# Altium schematic sheet ALU_Logic.SchDoc
size B; Author: E. Sims; Organization: Let's Build Rockets Inc.; SheetNumber: 1; SheetTotal: 7
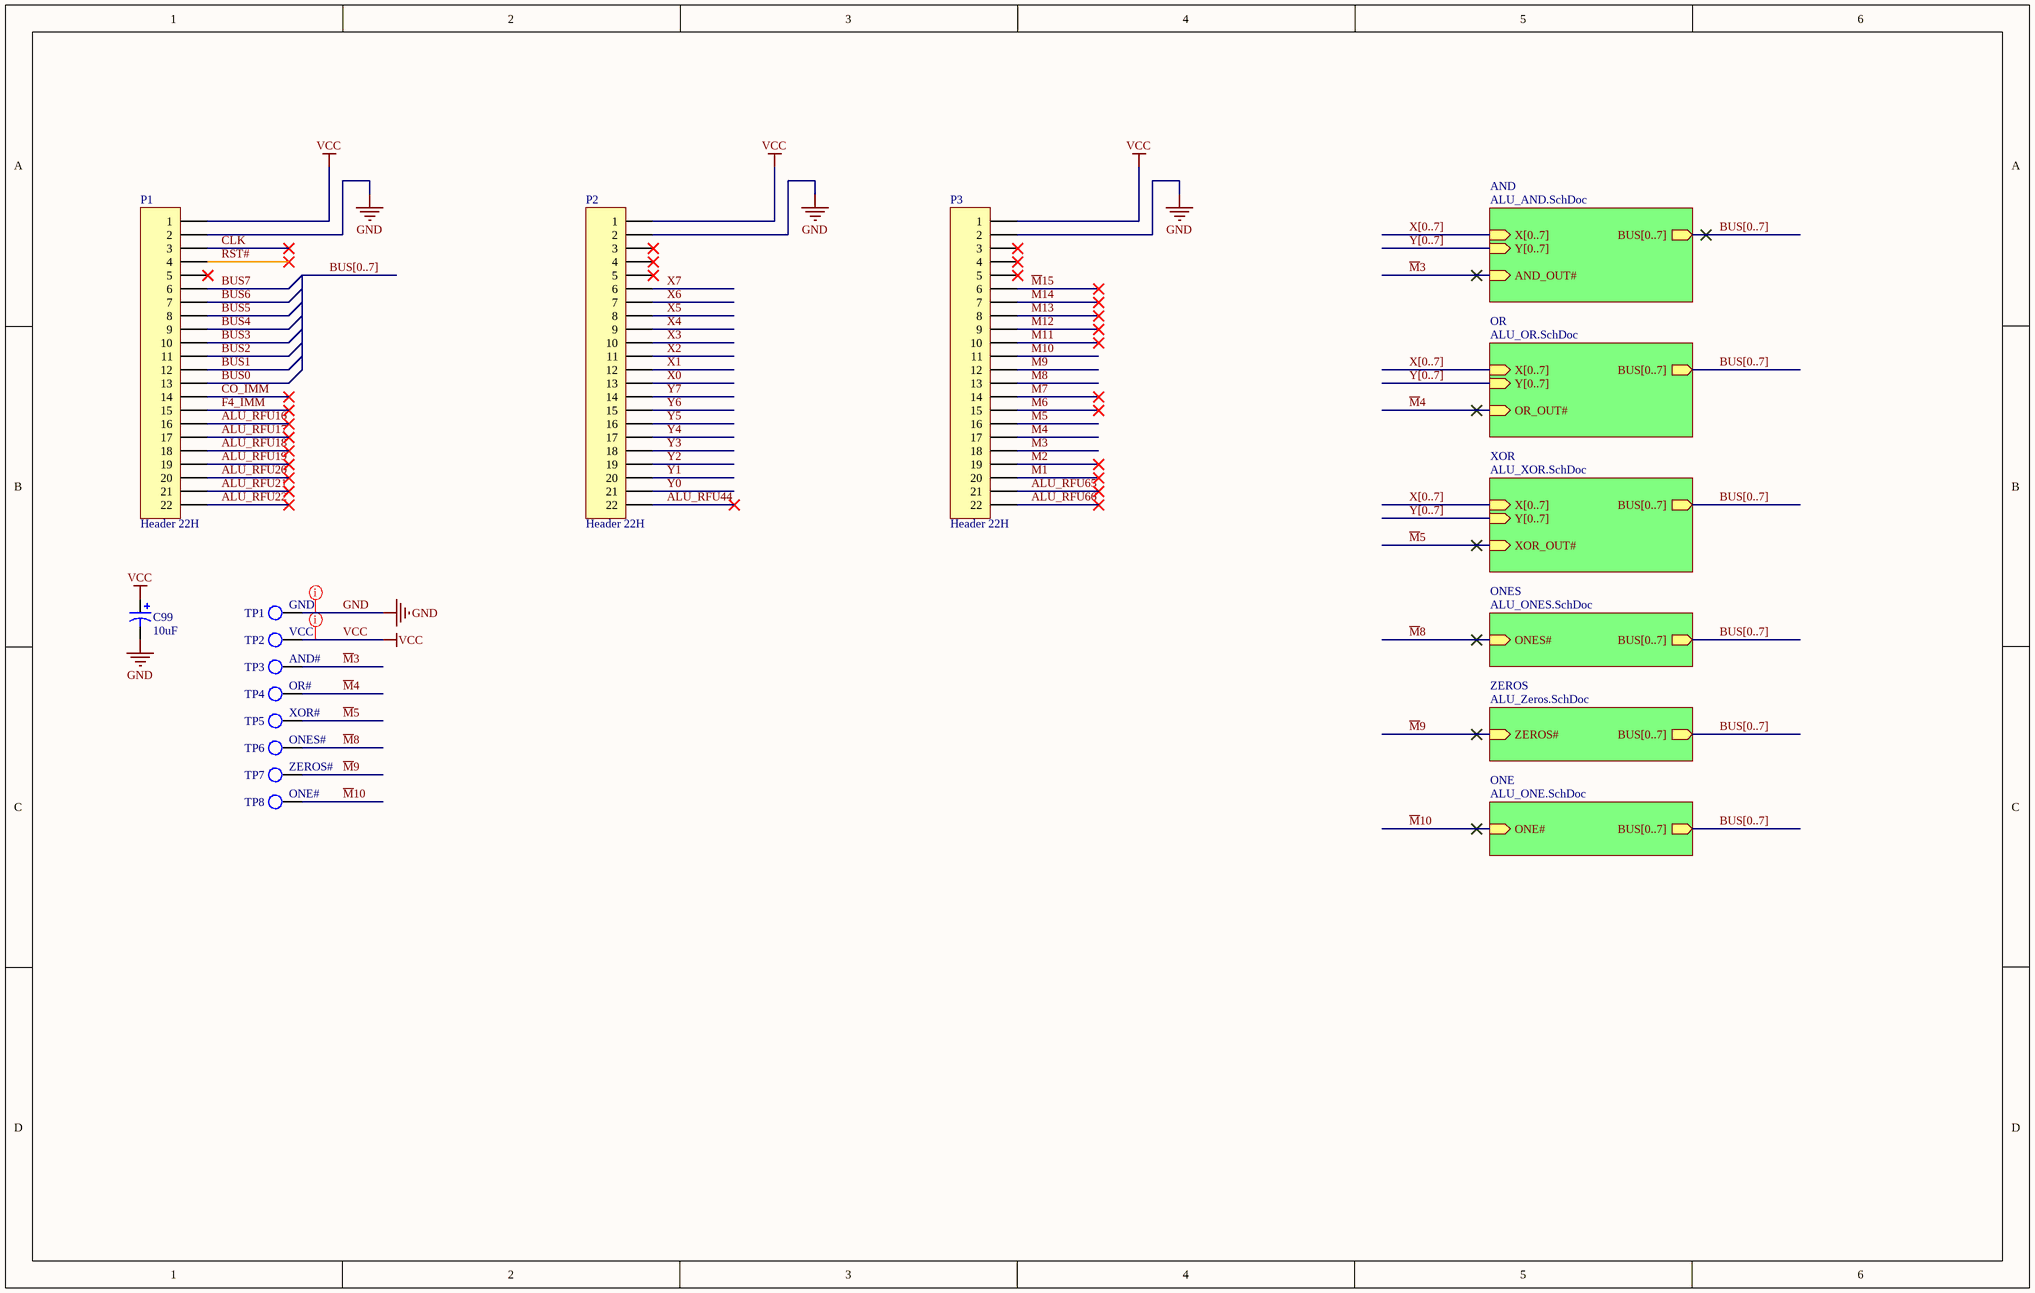
[diagram p0: ALU_Logic.SchDoc]

## Parts
C99  value 10uF  [C5x7]  (hidden comment: Cap Pol5)
P1  Header 22H  [HDR1X22H]
P2  Header 22H  [HDR1X22H]
P3  Header 22H  [HDR1X22H]
TP1  GND  [KSTN-5011_V]  (no BOM)
TP2  VCC  [KSTN-5011_V]  (no BOM)
TP3  AND#  [KSTN-5011_V]  (no BOM)
TP4  OR#  [KSTN-5011_V]  (no BOM)
TP5  XOR#  [KSTN-5011_V]  (no BOM)
TP6  ONES#  [KSTN-5011_V]  (no BOM)
TP7  ZEROS#  [KSTN-5011_V]  (no BOM)
TP8  ONE#  [KSTN-5011_V]  (no BOM)

## Sub-sheets
AND = ALU_AND.SchDoc: X[0..7] (in), Y[0..7] (in), BUS[0..7] (out), AND_OUT# (in)
ONE = ALU_ONE.SchDoc: BUS[0..7] (out), ONE# (in)
ONES = ALU_ONES.SchDoc: BUS[0..7] (out), ONES# (in)
OR = ALU_OR.SchDoc: X[0..7] (in), Y[0..7] (in), BUS[0..7] (out), OR_OUT# (in)
XOR = ALU_XOR.SchDoc: X[0..7] (in), Y[0..7] (in), BUS[0..7] (out), XOR_OUT# (in)
ZEROS = ALU_Zeros.SchDoc: BUS[0..7] (out), ZEROS# (in)

## Nets
GND: C99.2 P1.2 P2.2 P3.2 TP1.1
VCC: C99.1 P1.1 P2.1 P3.1 TP2.1
ALU_RFU16: P1.16
ALU_RFU17: P1.17
ALU_RFU18: P1.18
ALU_RFU19: P1.19
ALU_RFU20: P1.20
ALU_RFU21: P1.21
ALU_RFU22: P1.22
ALU_RFU44: P2.22
ALU_RFU65: P3.21
ALU_RFU66: P3.22
BUS0: P1.13
BUS1: P1.12
BUS2: P1.11
BUS3: P1.10
BUS4: P1.9
BUS5: P1.8
BUS6: P1.7
BUS7: P1.6
CLK: P1.3
CO_IMM: P1.14
F4_IMM: P1.15
~{M}1: P3.20
~{M}2: P3.19
~{M}3: P3.18 TP3.1 ; sheet AND/AND_OUT#
~{M}4: P3.17 TP4.1 ; sheet OR/OR_OUT#
~{M}5: P3.16 TP5.1 ; sheet XOR/XOR_OUT#
~{M}6: P3.15
~{M}7: P3.14
~{M}8: P3.13 TP6.1 ; sheet ONES/ONES#
~{M}9: P3.12 TP7.1 ; sheet ZEROS/ZEROS#
~{M}10: P3.11 TP8.1 ; sheet ONE/ONE#
~{M}11: P3.10
~{M}12: P3.9
~{M}13: P3.8
~{M}14: P3.7
~{M}15: P3.6
RST#: P1.4
X0: P2.13
X1: P2.12
X2: P2.11
X3: P2.10
X4: P2.9
X5: P2.8
X6: P2.7
X7: P2.6
Y0: P2.21
Y1: P2.20
Y2: P2.19
Y3: P2.18
Y4: P2.17
Y5: P2.16
Y6: P2.15
Y7: P2.14

Not connected (* = marked no-connect by the designer): P1 5*; P2 3* 4* 5*; P3 3* 4* 5*

## Buses and harness runs
bus BUS[0..7]
bus BUS[0..7] = sheet AND/BUS[0..7]
bus BUS[0..7] = sheet ONE/BUS[0..7]
bus BUS[0..7] = sheet ONES/BUS[0..7]
bus BUS[0..7] = sheet OR/BUS[0..7]
bus BUS[0..7] = sheet XOR/BUS[0..7]
bus BUS[0..7] = sheet ZEROS/BUS[0..7]
bus X[0..7] = sheet AND/X[0..7]
bus X[0..7] = sheet OR/X[0..7]
bus X[0..7] = sheet XOR/X[0..7]
bus Y[0..7] = sheet AND/Y[0..7]
bus Y[0..7] = sheet OR/Y[0..7]
bus Y[0..7] = sheet XOR/Y[0..7]

## Layout directives
rule Width Constraint [Pref Width = 20mil    Min Width = 20mil    Max Width = 50mil]; rule Routing Via Style [Pref Size = 35mil    Pref Hole Size = 20mil]; net class PWR: GND, VCC

## Notes on the sheet
- Let's Build Rocket's Inc. Modular Paylaod System Based on TMP-010 Rev
  For more information visit https://github.com/LetsBuildRockets/Modular-Payload-System
  This work is licensed under CC BY-NC 4.0. To view a copy of this license, visit https://creativecommons.org/licenses/by-nc/4.0
- Title
- Size:
- Date:
- Assembly Variant:
- B
- Number:
- Time:
- Revision:
- Sheet
- of
- Author:
- File:

## Library data of the parts
C99 = Cap Pol5: Polarized Capacitor; Published: 8-Jun-2000; LatestRevisionDate: 17-Jul-2002; LatestRevisionNote: Re-released for DXP Platform.; PackageReference: POLAR0.8; Publisher: Altium Limited; PackageDescription: Polarized Capacitor; 2 Leads
P1-P3 = Header 22H: Header, 22-Pin, Right Angle; System: Connector; LatestRevisionDate: 17-Jul-2002; LatestRevisionNote: Re-released for DXP Platform.; Publisher: Altium Limited
TP1-TP8 = TP